# Altium schematic sheet управление+отладка.SchDoc
size A3; Organization: Altium Limited; Address1: L3, 12a Rodborough Rd; Address2: Frenchs Forest; Address3: NSW; Address4: Australia 2086
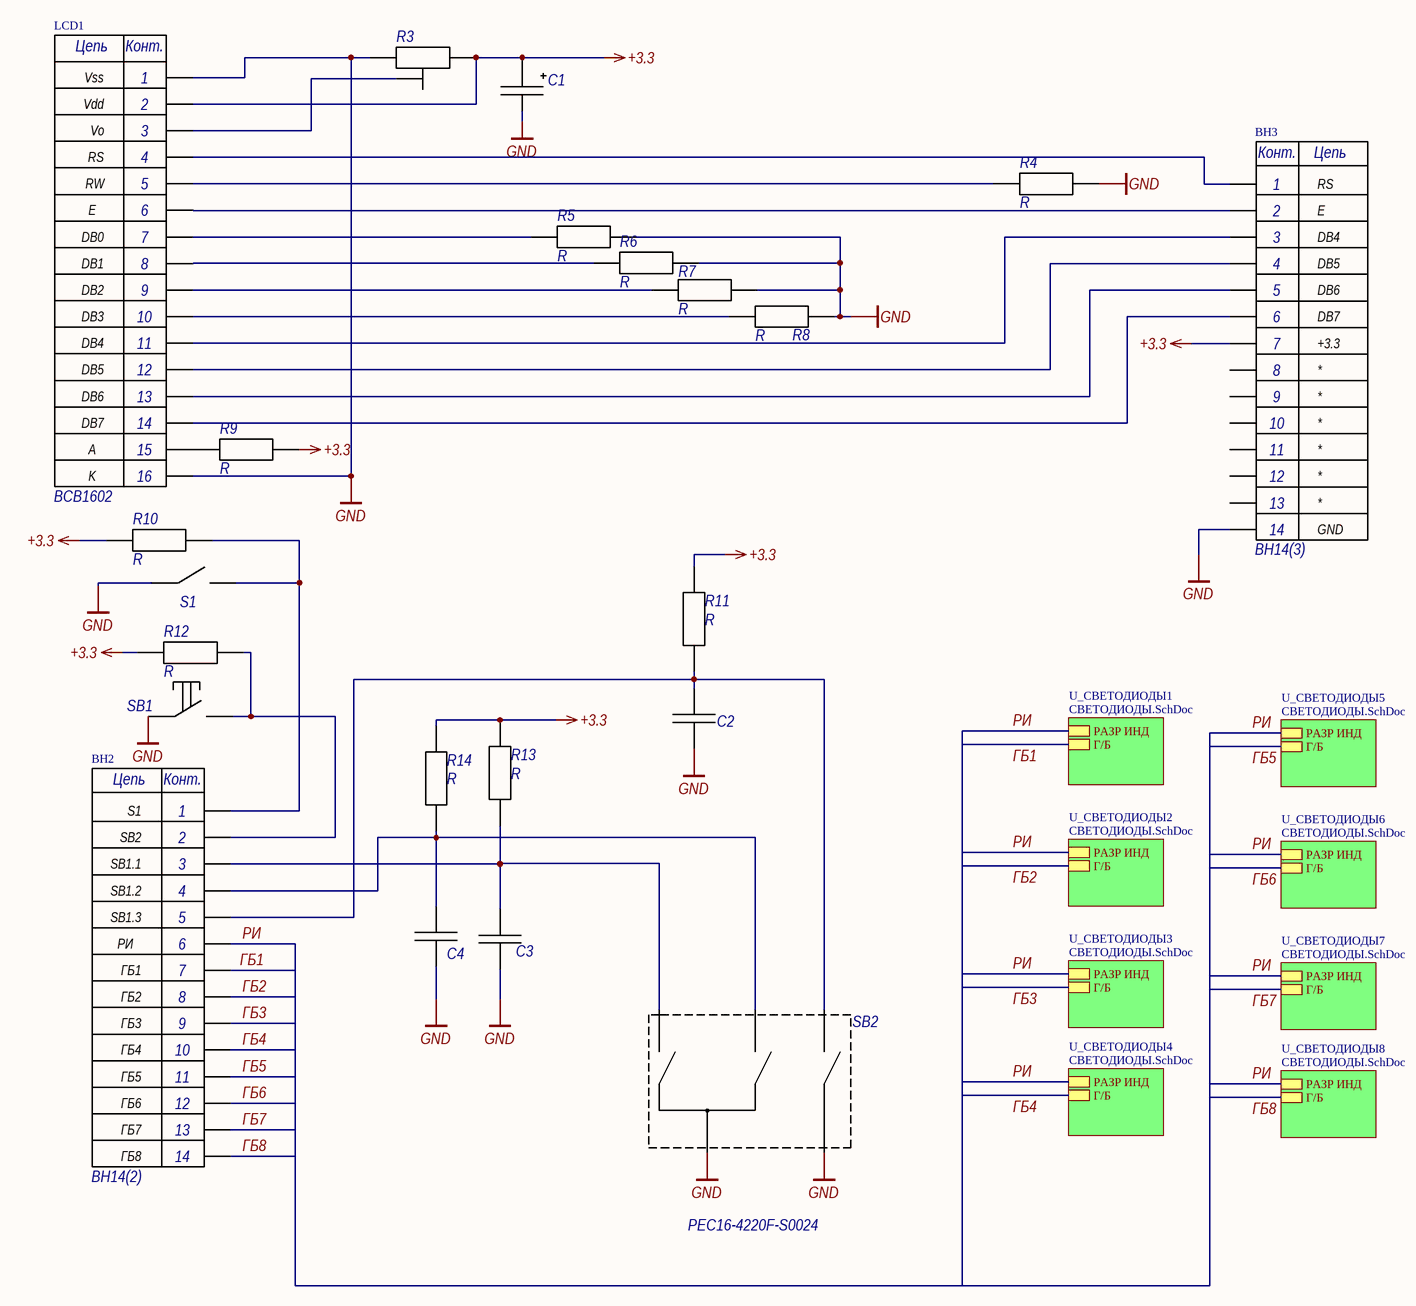
[diagram p0: управление+отладка.SchDoc]

## Parts
BH2  BH14(2)  [BH-14 (DS1013-14S) (IDC-14MS)]
BH3  BH14(3)  [BH-14 (DS1013-14S) (IDC-14MS)]
C1  C(AlEL)  [C(AlEL)]  (value not drawn)
C2  C(ceramic)  [C(ceramic)]  (value not drawn)
C3  C(ceramic)  [C(ceramic)]  (value not drawn)
C4  C(ceramic)  [C(ceramic)]  (value not drawn)
LCD1  BCB1602  [BCB1602]
R3  Comment  [R(подстр)]  (value not drawn)
R4  R  [R]
R5  R  [R]
R6  R  [R]
R7  R  [R]
R8  R  [R]
R9  R  [R]
R10  R  [R]
R11  R  [R]
R12  R  [R]
R13  R  [R]
R14  R  [R]
S1  (?)тумблер  [MTS-2]  (value not drawn)
SB1  ПУСК  [кнопка]  (value not drawn)
SB2  PEC16-4220F-S0024  [PEC16-4220F-S0024]

## Sub-sheets
U_СВЕТОДИОДЫ1 = СВЕТОДИОДЫ.SchDoc: РАЗР ИНД, Г/Б
U_СВЕТОДИОДЫ2 = СВЕТОДИОДЫ.SchDoc: РАЗР ИНД, Г/Б
U_СВЕТОДИОДЫ3 = СВЕТОДИОДЫ.SchDoc: РАЗР ИНД, Г/Б
U_СВЕТОДИОДЫ4 = СВЕТОДИОДЫ.SchDoc: РАЗР ИНД, Г/Б
U_СВЕТОДИОДЫ5 = СВЕТОДИОДЫ.SchDoc: РАЗР ИНД, Г/Б
U_СВЕТОДИОДЫ6 = СВЕТОДИОДЫ.SchDoc: РАЗР ИНД, Г/Б
U_СВЕТОДИОДЫ7 = СВЕТОДИОДЫ.SchDoc: РАЗР ИНД, Г/Б
U_СВЕТОДИОДЫ8 = СВЕТОДИОДЫ.SchDoc: РАЗР ИНД, Г/Б

## Nets
+3.3: BH3.7(+3.3) C1.1 LCD1.2(Vdd) R3.1 R9.2 R10.1 R11.2 R12.1 R13.2 R14.2
GND: BH3.14(GND) C1.2 C2.1 C3.1 C4.1 LCD1.1(Vss) LCD1.16(K) R3.2 R4.2 R5.2 R6.2 R7.2 R8.2 S1.1 SB1.1 SB2.2 SB2.4
ГБ1: BH2.7(ГБ1) ; sheet U_СВЕТОДИОДЫ1/Г/Б
ГБ2: BH2.8(ГБ2) ; sheet U_СВЕТОДИОДЫ2/Г/Б
ГБ3: BH2.9(ГБ3) ; sheet U_СВЕТОДИОДЫ3/Г/Б
ГБ4: BH2.10(ГБ4) ; sheet U_СВЕТОДИОДЫ4/Г/Б
ГБ5: BH2.11(ГБ5) ; sheet U_СВЕТОДИОДЫ5/Г/Б
ГБ6: BH2.12(ГБ6) ; sheet U_СВЕТОДИОДЫ6/Г/Б
ГБ7: BH2.13(ГБ7) ; sheet U_СВЕТОДИОДЫ7/Г/Б
ГБ8: BH2.14(ГБ8) ; sheet U_СВЕТОДИОДЫ8/Г/Б
РИ: BH2.6(РИ) ; sheet U_СВЕТОДИОДЫ1/РАЗР ИНД, sheet U_СВЕТОДИОДЫ2/РАЗР ИНД, sheet U_СВЕТОДИОДЫ3/РАЗР ИНД, sheet U_СВЕТОДИОДЫ4/РАЗР ИНД, sheet U_СВЕТОДИОДЫ5/РАЗР ИНД, sheet U_СВЕТОДИОДЫ6/РАЗР ИНД, sheet U_СВЕТОДИОДЫ7/РАЗР ИНД, sheet U_СВЕТОДИОДЫ8/РАЗР ИНД
NetBH2_1: BH2.1(S1) R10.2 S1.2
NetBH2_2: BH2.2(SB2) R12.2 SB1.2
NetBH2_3: BH2.3(SB1.1) C3.2 R13.1 SB2.1
NetBH2_4: BH2.4(SB1.2) C4.2 R14.1 SB2.3
NetBH2_5: BH2.5(SB1.3) C2.2 R11.1 SB2.5
NetBH3_1: BH3.1(RS) LCD1.4(RS)
NetBH3_2: BH3.2(E) LCD1.6(E)
NetBH3_3: BH3.3(DB4) LCD1.11(DB4)
NetBH3_4: BH3.4(DB5) LCD1.12(DB5)
NetBH3_5: BH3.5(DB6) LCD1.13(DB6)
NetBH3_6: BH3.6(DB7) LCD1.14(DB7)
NetLCD1_3: LCD1.3(Vo) R3.3
NetLCD1_5: LCD1.5(RW) R4.1
NetLCD1_7: LCD1.7(DB0) R5.1
NetLCD1_8: LCD1.8(DB1) R6.1
NetLCD1_9: LCD1.9(DB2) R7.1
NetLCD1_10: LCD1.10(DB3) R8.1
NetLCD1_15: LCD1.15(A) R9.1

Not connected (* = marked no-connect by the designer): BH3 8(*) 9(*) 10(*) 11(*) 12(*) 13(*)

## Notes on the sheet
- Title
- Size:
- Date:
- A3
- Number:
- Time:
- Revision:
- Sheet
- of
- File:
- (in symbol BCB1602) Цепь; Конт.
- (in symbol BH14(2)) Цепь; Конт.
- (in symbol BH14(3)) Конт.; Цепь

## Library data of the parts
R3 = R(подстр)
SB1 = кнопка